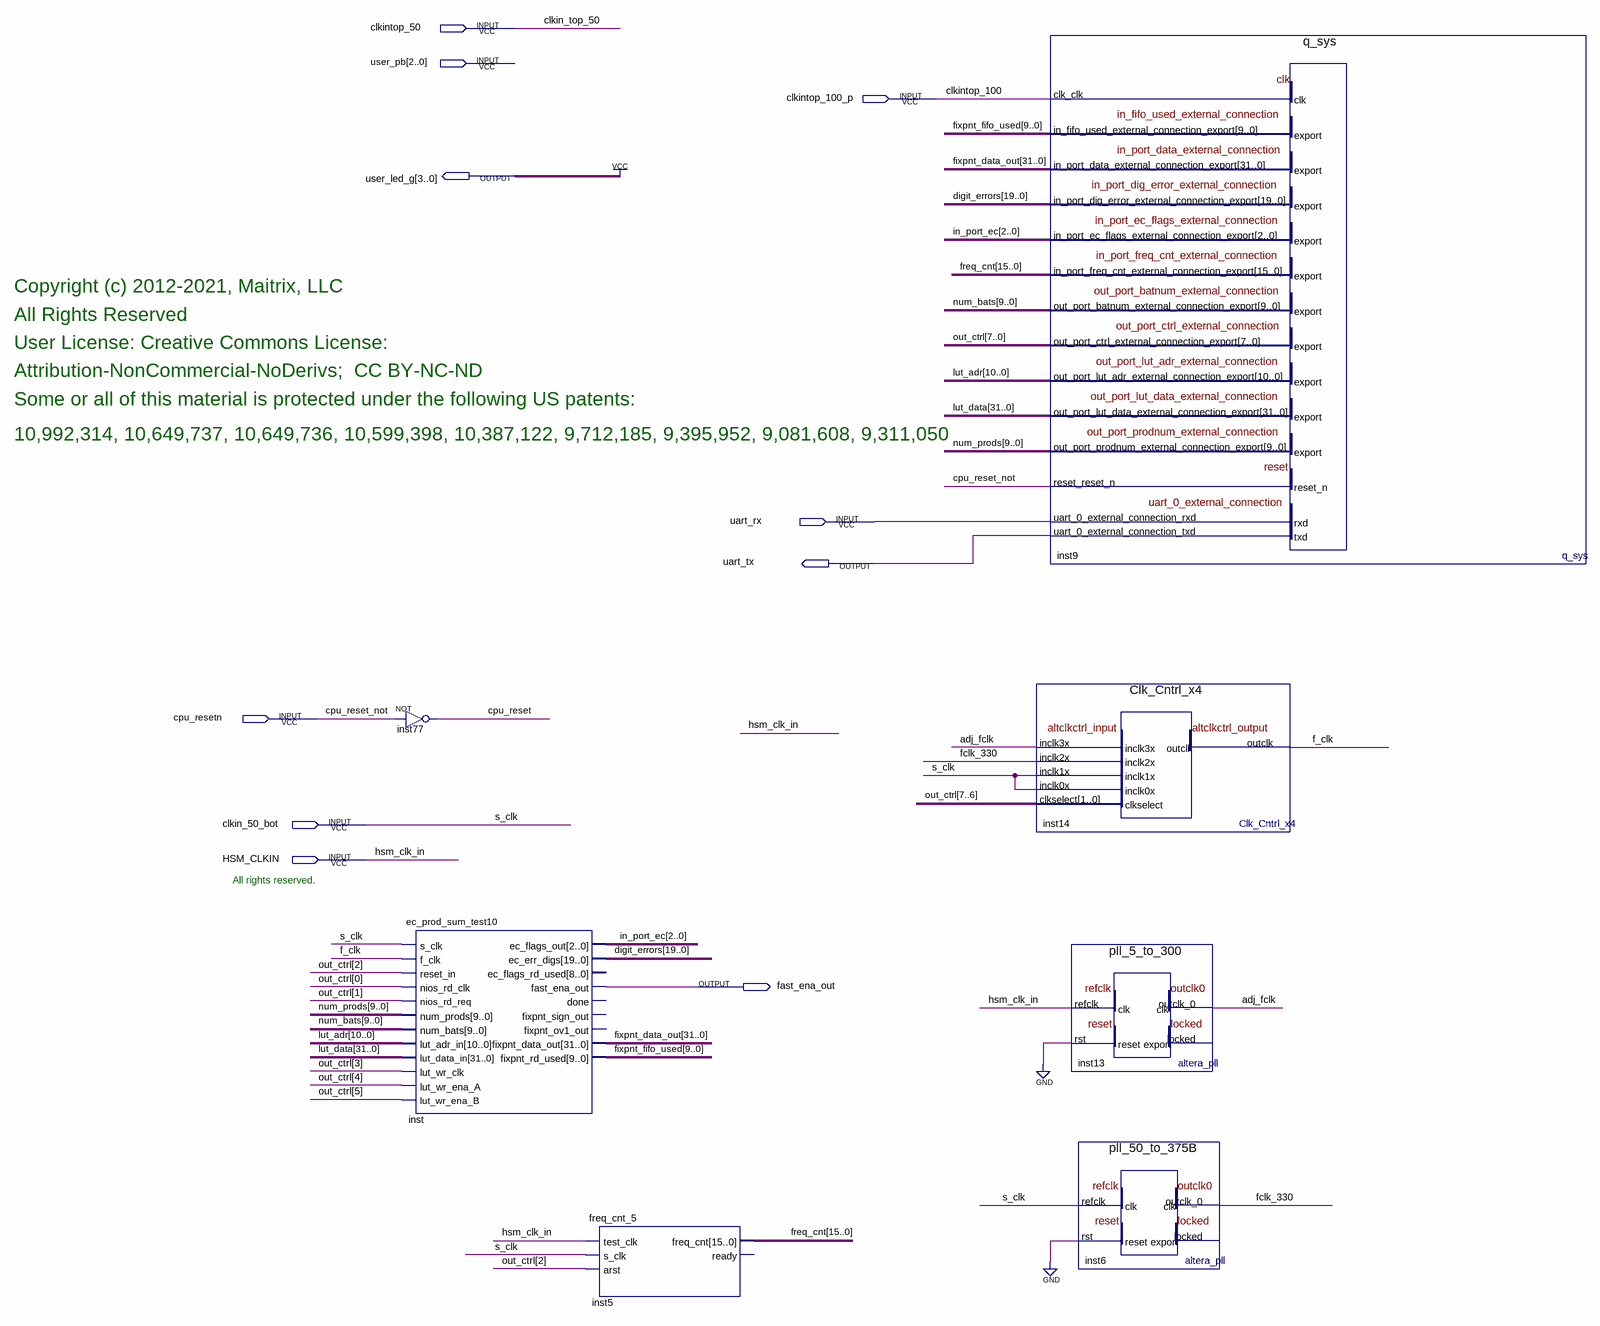
[diagram p0: schematic sheet]
// Quartus schematic Nios_ddr3_ver1.bdf as structural Verilog: 7 symbols, 10 pins
module Nios_ddr3_ver1 (
  input  clkintop_50,
  input  [2:0] user_pb,
  input  clkintop_100_p,
  input  uart_rx,
  input  cpu_resetn,
  input  clkin_50_bot,
  input  HSM_CLKIN,
  output [3:0] user_led_g,
  output uart_tx,
  output fast_ena_out
);

  wire adj_fclk, cpu_reset, f_clk, fclk_330;
  wire [2:0] in_port_ec;
  wire [7:0] out_ctrl;
  wire [9:0] fixpnt_fifo_used, num_bats, num_prods;
  wire [10:0] lut_adr;
  wire [15:0] freq_cnt;
  wire [19:0] digit_errors;
  wire [31:0] fixpnt_data_out, lut_data;

  not inst77 (cpu_reset, cpu_resetn);
  ec_prod_sum_test10 inst (
    .s_clk(clkin_50_bot), .f_clk(f_clk), .reset_in(out_ctrl[2]), .nios_rd_clk(out_ctrl[0]),
    .nios_rd_req(out_ctrl[1]), .lut_wr_clk(out_ctrl[3]), .lut_wr_ena_B(out_ctrl[5]),
    .lut_wr_ena_A(out_ctrl[4]), .lut_adr_in(lut_adr), .lut_data_in(lut_data), .num_bats(num_bats),
    .num_prods(num_prods), .fast_ena_out(fast_ena_out), .ec_err_digs(digit_errors),
    .ec_flags_out(in_port_ec), .fixpnt_data_out(fixpnt_data_out), .fixpnt_rd_used(fixpnt_fifo_used));  // open: done, fixpnt_sign_out, fixpnt_ov1_out, ec_flags_rd_used
  freq_cnt_5 inst5 (
    .test_clk(HSM_CLKIN), .s_clk(clkin_50_bot), .arst(out_ctrl[2]), .freq_cnt(freq_cnt));  // open: ready
  q_sys inst9 (
    .clk_clk(clkintop_100_p), .in_fifo_used_external_connection_export(fixpnt_fifo_used),
    .in_port_data_external_connection_export(fixpnt_data_out),
    .in_port_dig_error_external_connection_export(digit_errors),
    .in_port_ec_flags_external_connection_export(in_port_ec),
    .in_port_freq_cnt_external_connection_export(freq_cnt), .reset_reset_n(cpu_resetn),
    .uart_0_external_connection_rxd(uart_rx), .out_port_batnum_external_connection_export(num_bats),
    .out_port_ctrl_external_connection_export(out_ctrl),
    .out_port_lut_adr_external_connection_export(lut_adr),
    .out_port_lut_data_external_connection_export(lut_data),
    .out_port_prodnum_external_connection_export(num_prods), .uart_0_external_connection_txd(uart_tx));
  Clk_Cntrl_x4 inst14 (
    .inclk3x(adj_fclk), .inclk2x(fclk_330), .inclk1x(clkin_50_bot), .inclk0x(clkin_50_bot),
    .clkselect(out_ctrl[7:6]), .outclk(f_clk));
  pll_5_to_300 inst13 (.refclk(HSM_CLKIN), .rst(1'b0), .outclk_0(adj_fclk));  // open: locked
  pll_50_to_375B inst6 (.refclk(clkin_50_bot), .rst(1'b0), .outclk_0(fclk_330));  // open: locked

  assign user_led_g = 4'b1111;

  // Other names for the same wires on the sheet: clkin_top_50 = clkintop_50; clkintop_100 = clkintop_100_p;
  //   cpu_reset_not = cpu_resetn; hsm_clk_in = HSM_CLKIN; s_clk = clkin_50_bot

  // Notes on the sheet:
  //   Copyright (c) 2012-2021, Maitrix, LLC
  //   All Rights Reserved
  //   User License: Creative Commons License: 
  //   Attribution-NonCommercial-NoDerivs;  CC BY-NC-ND
  //   Some or all of this material is protected under the following US patents: 
  //   10,992,314, 10,649,737, 10,649,736, 10,599,398, 10,387,122, 9,712,185, 9,395,952, 9,081,608, 9,311,050
  //   All rights reserved.
endmodule
